# EAGLE schematic Impedance_Measurement_System (EAGLE 9.6.2)
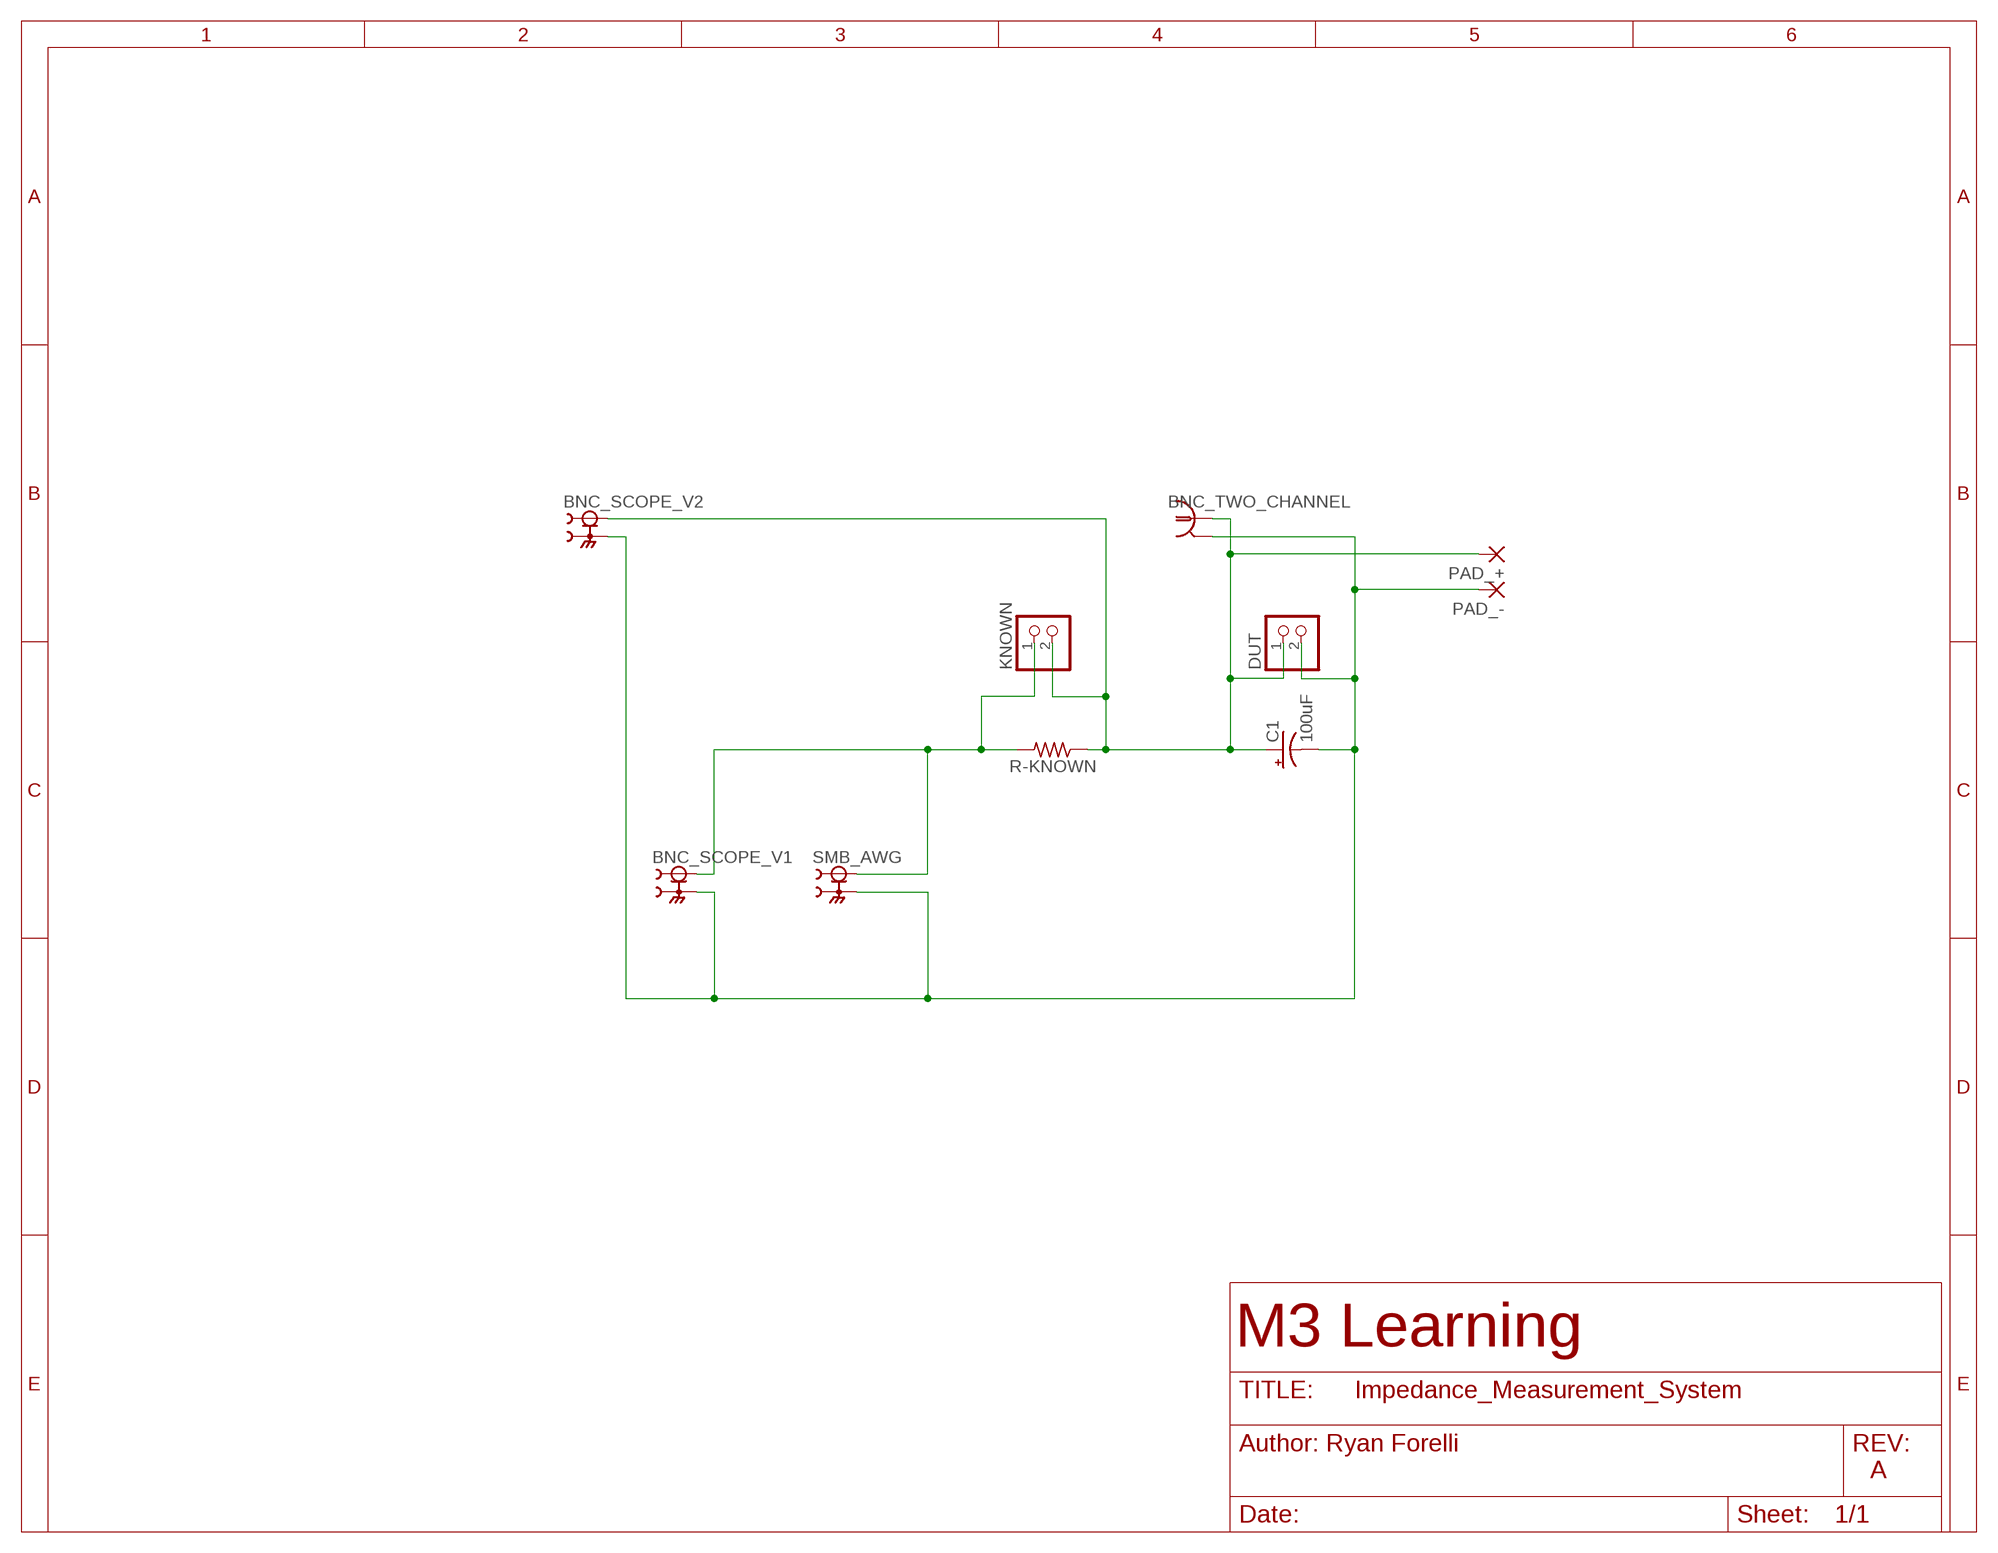
[diagram p0: schematic, sheet 1]

## Parts
BNC_SCOPE_V1  CONSMB006-G  [LINX_CONSMB006-G]
BNC_SCOPE_V2  CONSMB006-G  [LINX_CONSMB006-G]
BNC_TWO_CHANNEL  112404  [112404]
C1  100uF  10UF-POLAR-RADIAL-2.5MM-25V-20%  [CPOL-RADIAL-2.5MM-5MM]
DUT  PINHD-1X2  [1X02]
KNOWN  PINHD-1X2  [1X02]
PAD_+  SMD5  [SMD2,54-5,08]
PAD_-  SMD5  [SMD2,54-5,08]
R-KNOWN  10K  R-US_0204/7  [0204/7]
SMB_AWG  CONSMB006-G  [LINX_CONSMB006-G]

## Nets
N$1: BNC_SCOPE_V1.1 KNOWN.1 R-KNOWN.2 SMB_AWG.1
N$2: BNC_SCOPE_V1.G1 BNC_SCOPE_V1.G2 BNC_SCOPE_V1.G3 BNC_SCOPE_V1.G4 BNC_SCOPE_V2.G1 BNC_SCOPE_V2.G2 BNC_SCOPE_V2.G3 BNC_SCOPE_V2.G4 BNC_TWO_CHANNEL.2 BNC_TWO_CHANNEL.3 BNC_TWO_CHANNEL.4 BNC_TWO_CHANNEL.5 C1.2(-) DUT.2 PAD_-.1(P) SMB_AWG.G1 SMB_AWG.G2 SMB_AWG.G3 SMB_AWG.G4
N$3: BNC_SCOPE_V2.1 BNC_TWO_CHANNEL.1 C1.1(+) DUT.1 KNOWN.2 PAD_+.1(P) R-KNOWN.1

## Notes on the sheet
- M3 Learning
- A

## Library data of the parts
BNC_SCOPE_V1 BNC_SCOPE_V2 SMB_AWG = CONSMB006-G:CONSMB006-G: SMB Plug (female socket) PCB through hole connector Check prices <https://pricing.snapeda.com/parts/CONSMB006-G/Linx%20Technologies%20Inc./view-part?ref=eda>; AVAILABILITY: In Stock; DESCRIPTION: SMB Connector Plug, Female Socket 50 Ohm Through Hole Solder; MF: Linx Technologies Inc.; MP: CONSMB006-G; PACKAGE: None; PRICE: None
BNC_TWO_CHANNEL = 112404:112404: Amphenol Connex 112404 BNC P. C. Mount Recept. Jack Source: http://www.amphenolconnex.com/media/downloads/3157/112404.pdf Check prices <https://pricing.snapeda.com/parts/112404/Amphenol%20RF/view-part?ref=eda> Check prices <https://pricing.snapeda.com/parts/112404/Amphenol%20RF/view-part?ref=eda> Check prices <https://pricing.snapeda.com/parts/112404/Amphenol%20RF/view-part?ref=eda>; AVAILABILITY: In Stock; DESCRIPTION: BNC Connector Jack, Female Socket 50Ohm Through Hole Solder; MF: Amphenol RF; MP: 112404; PACKAGE: None; PRICE: None
C1 = SparkFun-Capacitors:10UF-POLAR: 10.0µF polarized capacitors A capacitor is a passive two-terminal electrical component used to store electrical energy temporarily in an electric field.; PROD_ID: CAP-08440; VALUE: 10uF
DUT KNOWN = pinhead:PINHD-1X2: PIN HEADER
PAD_+ PAD_- = wirepad:SMD5: SMD PAD
R-KNOWN = rcl:R-US_: RESISTOR, American symbol; SPICEPREFIX: R